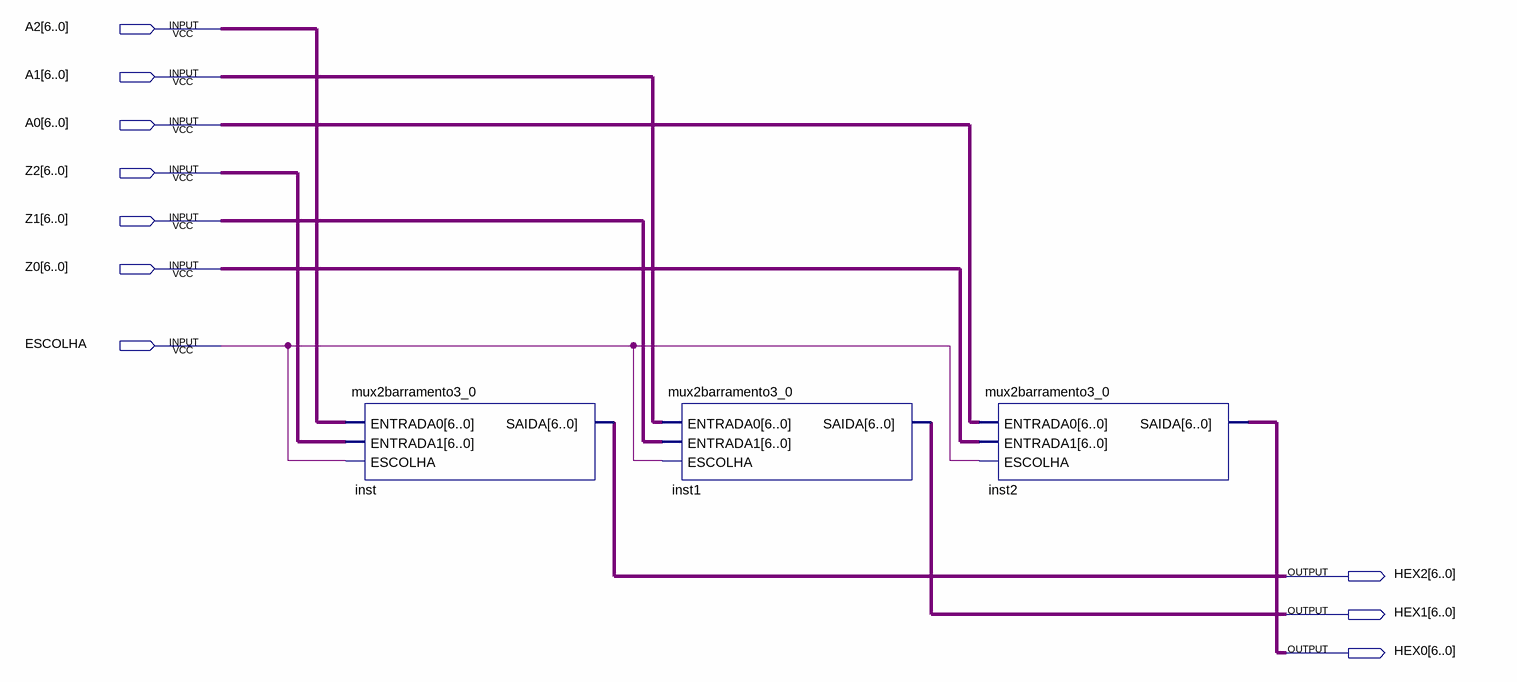
[diagram p0: schematic sheet]
// Quartus schematic mux2barramento6_0.bdf as structural Verilog: 3 symbols, 10 pins
module mux2barramento6_0 (
  input  [6:0] A2,
  input  [6:0] A1,
  input  [6:0] A0,
  input  [6:0] Z2,
  input  [6:0] Z1,
  input  [6:0] Z0,
  input  ESCOLHA,
  output [6:0] HEX2,
  output [6:0] HEX1,
  output [6:0] HEX0
);

  mux2barramento3_0 inst (.ENTRADA0(A2), .ENTRADA1(Z2), .ESCOLHA(ESCOLHA), .SAIDA(HEX2));
  mux2barramento3_0 inst1 (.ENTRADA0(A1), .ENTRADA1(Z1), .ESCOLHA(ESCOLHA), .SAIDA(HEX1));
  mux2barramento3_0 inst2 (.ENTRADA0(A0), .ENTRADA1(Z0), .ESCOLHA(ESCOLHA), .SAIDA(HEX0));
endmodule
